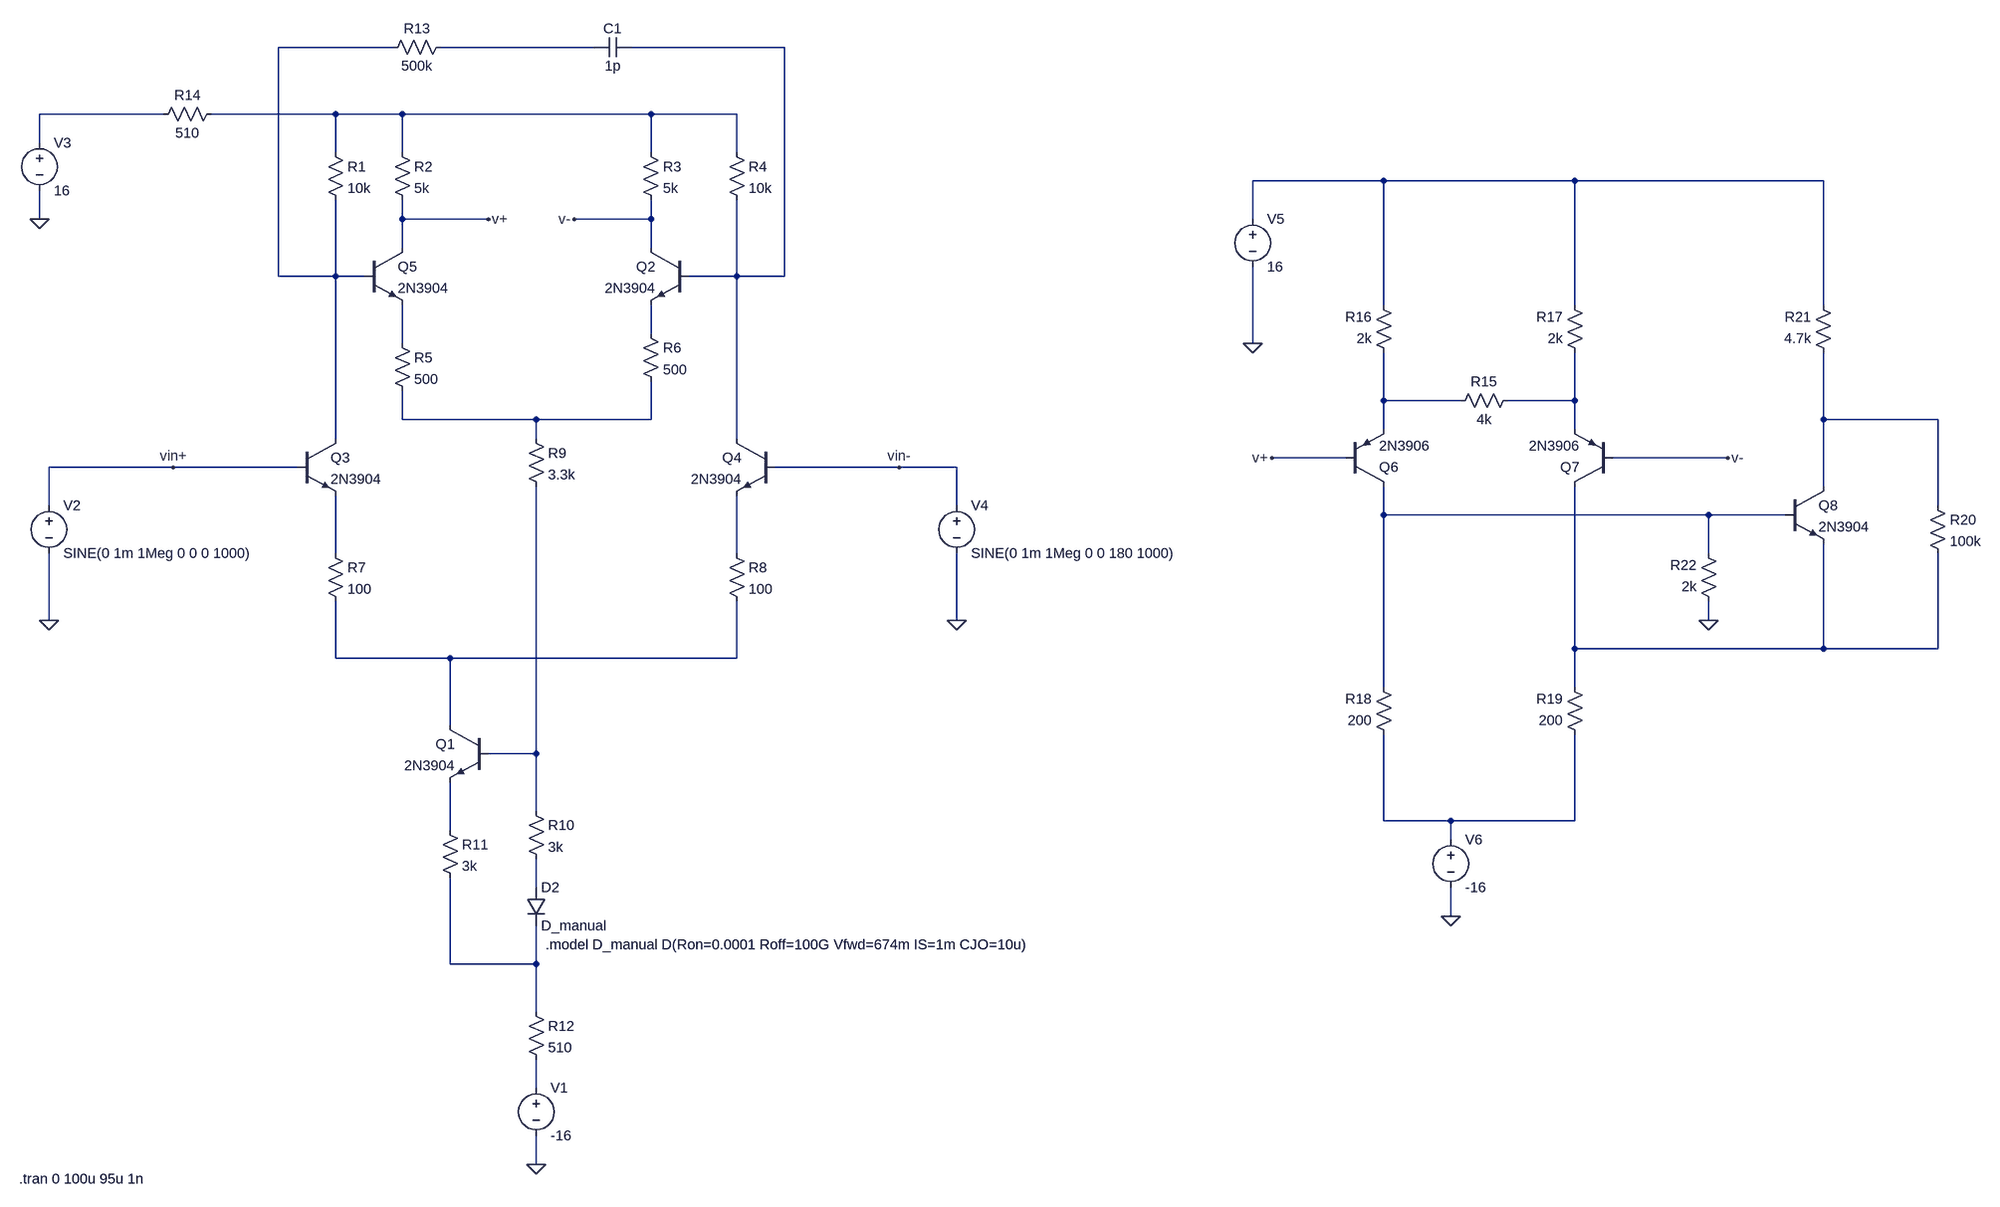
[diagram p0: schematic Amplifier.asc]
Amplifier.asc, the LTspice schematic file:
Version 4
SHEET 1 3152 1608
WIRE 0 -304 -192 -304
WIRE 336 -304 80 -304
WIRE 656 -304 400 -304
WIRE -384 -192 -592 -192
WIRE -96 -192 -304 -192
WIRE 16 -192 -96 -192
WIRE 432 -192 16 -192
WIRE 576 -192 432 -192
WIRE -592 -144 -592 -192
WIRE -96 -128 -96 -192
WIRE 16 -128 16 -192
WIRE 432 -128 432 -192
WIRE 576 -128 576 -192
WIRE 2016 -80 1728 -80
WIRE 2336 -80 2016 -80
WIRE 2752 -80 2336 -80
WIRE -592 -16 -592 -64
WIRE 16 -16 16 -48
WIRE 160 -16 16 -16
WIRE 432 -16 432 -48
WIRE 432 -16 304 -16
WIRE 1728 -16 1728 -80
WIRE 16 32 16 -16
WIRE 432 32 432 -16
WIRE -192 80 -192 -304
WIRE -96 80 -96 -48
WIRE -96 80 -192 80
WIRE -48 80 -96 80
WIRE 576 80 576 -48
WIRE 576 80 496 80
WIRE 656 80 656 -304
WIRE 656 80 576 80
WIRE 2016 128 2016 -80
WIRE 2336 128 2336 -80
WIRE 2752 128 2752 -80
WIRE 432 176 432 128
WIRE 16 192 16 128
WIRE 1728 192 1728 64
WIRE 2016 288 2016 208
WIRE 2144 288 2016 288
WIRE 2336 288 2336 208
WIRE 2336 288 2224 288
WIRE 16 320 16 272
WIRE 240 320 16 320
WIRE 432 320 432 256
WIRE 432 320 240 320
WIRE 2752 320 2752 208
WIRE 3072 320 2752 320
WIRE 2016 336 2016 288
WIRE 2336 336 2336 288
WIRE -96 352 -96 80
WIRE 240 352 240 320
WIRE 576 352 576 80
WIRE 1952 384 1760 384
WIRE 2592 384 2400 384
WIRE -368 400 -576 400
WIRE -160 400 -368 400
WIRE 848 400 640 400
WIRE 944 400 848 400
WIRE 2752 432 2752 320
WIRE -576 464 -576 400
WIRE 944 464 944 400
WIRE 3072 464 3072 320
WIRE 2016 480 2016 432
WIRE 2560 480 2016 480
WIRE 2688 480 2560 480
WIRE -96 544 -96 448
WIRE 576 544 576 448
WIRE 2560 544 2560 480
WIRE -576 656 -576 544
WIRE 944 656 944 544
WIRE 2560 656 2560 624
WIRE 2336 704 2336 432
WIRE 2752 704 2752 528
WIRE 2752 704 2336 704
WIRE 3072 704 3072 544
WIRE 3072 704 2752 704
WIRE -96 720 -96 624
WIRE 96 720 -96 720
WIRE 576 720 576 624
WIRE 576 720 96 720
WIRE 2016 768 2016 480
WIRE 2336 768 2336 704
WIRE 96 832 96 720
WIRE 240 880 240 432
WIRE 240 880 160 880
WIRE 240 976 240 880
WIRE 2016 992 2016 848
WIRE 2128 992 2016 992
WIRE 2336 992 2336 848
WIRE 2336 992 2128 992
WIRE 96 1008 96 928
WIRE 2128 1024 2128 992
WIRE 240 1104 240 1056
WIRE 2128 1152 2128 1104
WIRE 96 1232 96 1088
WIRE 240 1232 240 1168
WIRE 240 1232 96 1232
WIRE 240 1312 240 1232
WIRE 240 1440 240 1392
WIRE 240 1568 240 1520
FLAG 240 1568 0
FLAG 160 -16 v+
FLAG 304 -16 v-
FLAG -368 400 vin+
FLAG 848 400 vin-
FLAG -592 -16 0
FLAG -576 656 0
FLAG 944 656 0
FLAG 2128 1152 0
FLAG 2560 656 0
FLAG 1728 192 0
FLAG 1760 384 v+
FLAG 2592 384 v-
SYMBOL npn 160 832 M0
SYMATTR InstName Q1
SYMATTR Value 2N3904
SYMBOL npn 496 32 M0
SYMATTR InstName Q2
SYMATTR Value 2N3904
SYMBOL npn -160 352 R0
SYMATTR InstName Q3
SYMATTR Value 2N3904
SYMBOL npn 640 352 M0
SYMATTR InstName Q4
SYMATTR Value 2N3904
SYMBOL npn -48 32 R0
SYMATTR InstName Q5
SYMATTR Value 2N3904
SYMBOL res -112 -144 R0
SYMATTR InstName R1
SYMATTR Value 10k
SYMBOL res 0 -144 R0
SYMATTR InstName R2
SYMATTR Value 5k
SYMBOL res 416 -144 R0
SYMATTR InstName R3
SYMATTR Value 5k
SYMBOL res 560 -144 R0
SYMATTR InstName R4
SYMATTR Value 10k
SYMBOL res 0 176 R0
SYMATTR InstName R5
SYMATTR Value 500
SYMBOL res 416 160 R0
SYMATTR InstName R6
SYMATTR Value 500
SYMBOL res -112 528 R0
SYMATTR InstName R7
SYMATTR Value 100
SYMBOL res 560 528 R0
SYMATTR InstName R8
SYMATTR Value 100
SYMBOL res 224 336 R0
SYMATTR InstName R9
SYMATTR Value 3.3k
SYMBOL res 224 960 R0
SYMATTR InstName R10
SYMATTR Value 3k
SYMBOL res 80 992 R0
SYMATTR InstName R11
SYMATTR Value 3k
SYMBOL res 224 1296 R0
SYMATTR InstName R12
SYMATTR Value 510
SYMBOL voltage 240 1424 R0
WINDOW 123 0 0 Left 0
WINDOW 39 0 0 Left 0
SYMATTR InstName V1
SYMATTR Value -16
SYMBOL res 96 -320 R90
WINDOW 0 0 56 VBottom 2
WINDOW 3 32 56 VTop 2
SYMATTR InstName R13
SYMATTR Value 500k
SYMBOL cap 400 -320 R90
WINDOW 0 0 32 VBottom 2
WINDOW 3 32 32 VTop 2
SYMATTR InstName C1
SYMATTR Value 1p
SYMBOL voltage -576 448 R0
WINDOW 123 0 0 Left 0
WINDOW 39 0 0 Left 0
SYMATTR InstName V2
SYMATTR Value SINE(0 1m 1Meg 0 0 0 1000)
SYMBOL voltage -592 -160 R0
WINDOW 123 0 0 Left 0
WINDOW 39 0 0 Left 0
SYMATTR InstName V3
SYMATTR Value 16
SYMBOL res -288 -208 R90
WINDOW 0 0 56 VBottom 2
WINDOW 3 32 56 VTop 2
SYMATTR InstName R14
SYMATTR Value 510
SYMBOL voltage 944 448 R0
WINDOW 123 0 0 Left 0
WINDOW 39 0 0 Left 0
SYMATTR InstName V4
SYMATTR Value SINE(0 1m 1Meg 0 0 180 1000)
SYMBOL diode 224 1104 R0
SYMATTR InstName D2
SYMATTR Value D_manual
SYMBOL pnp 1952 432 M180
SYMATTR InstName Q6
SYMATTR Value 2N3906
SYMBOL pnp 2400 432 R180
SYMATTR InstName Q7
SYMATTR Value 2N3906
SYMBOL res 2240 272 R90
WINDOW 0 0 56 VBottom 2
WINDOW 3 32 56 VTop 2
SYMATTR InstName R15
SYMATTR Value 4k
SYMBOL res 2032 224 R180
WINDOW 0 36 76 Left 2
WINDOW 3 36 40 Left 2
SYMATTR InstName R16
SYMATTR Value 2k
SYMBOL res 2352 224 R180
WINDOW 0 36 76 Left 2
WINDOW 3 36 40 Left 2
SYMATTR InstName R17
SYMATTR Value 2k
SYMBOL res 2032 864 R180
WINDOW 0 36 76 Left 2
WINDOW 3 36 40 Left 2
SYMATTR InstName R18
SYMATTR Value 200
SYMBOL res 2352 864 R180
WINDOW 0 36 76 Left 2
WINDOW 3 36 40 Left 2
SYMATTR InstName R19
SYMATTR Value 200
SYMBOL npn 2688 432 R0
SYMATTR InstName Q8
SYMATTR Value 2N3904
SYMBOL res 2768 224 R180
WINDOW 0 36 76 Left 2
WINDOW 3 36 40 Left 2
SYMATTR InstName R21
SYMATTR Value 4.7k
SYMBOL voltage 1728 -32 R0
WINDOW 123 0 0 Left 0
WINDOW 39 0 0 Left 0
SYMATTR InstName V5
SYMATTR Value 16
SYMBOL voltage 2128 1008 R0
WINDOW 123 0 0 Left 0
WINDOW 39 0 0 Left 0
SYMATTR InstName V6
SYMATTR Value -16
SYMBOL res 2576 640 R180
WINDOW 0 36 76 Left 2
WINDOW 3 36 40 Left 2
SYMATTR InstName R22
SYMATTR Value 2k
SYMBOL res 3056 448 R0
SYMATTR InstName R20
SYMATTR Value 100k
TEXT -626 1592 Left 2 !.tran 0 100u 95u 1n
TEXT 256 1200 Left 2 !.model D_manual D(Ron=0.0001 Roff=100G Vfwd=674m IS=1m CJO=10u)

The netlist it stands for:
* Amplifier.asc
Q1 N017 N018 N020 0 2N3904
Q2 v- N003 N007 0 2N3904
Q3 N001 vin+ N014 0 2N3904
Q4 N003 vin- N015 0 2N3904
Q5 v+ N001 N008 0 2N3904
R1 N005 N001 10k
R2 N005 v+ 5k
R3 N005 v- 5k
R4 N005 N003 10k
R5 N008 N011 500
R6 N007 N011 500
R7 N014 N017 100
R8 N015 N017 100
R9 N011 N018 3.3k
R10 N018 N021 3k
R11 N020 N022 3k
R12 N022 N023 510
V1 N023 0 -16
R13 N002 N001 500k
C1 N003 N002 1p
V2 vin+ 0 SINE(0 1m 1Meg 0 0 0 1000)
V3 N004 0 16
R14 N005 N004 510
V4 vin- 0 SINE(0 1m 1Meg 0 0 180 1000)
D2 N021 N022 D_manual
Q6 N013 v+ N009 0 2N3906
Q7 N016 v- N010 0 2N3906
R15 N010 N009 4k
R16 N009 N006 2k
R17 N010 N006 2k
R18 N019 N013 200
R19 N019 N016 200
Q8 N012 N013 N016 0 2N3904
R21 N012 N006 4.7k
V5 N006 0 16
V6 N019 0 -16
R22 0 N013 2k
R20 N012 N016 100k
.model D D
.lib standard.dio
.model NPN NPN
.model PNP PNP
.lib standard.bjt
.tran 0 100u 95u 1n
.model D_manual D(Ron=0.0001 Roff=100G Vfwd=674m IS=1m CJO=10u)
.backanno
.end